# EAGLE design IN-2 Clock (EAGLE 8.1.0)
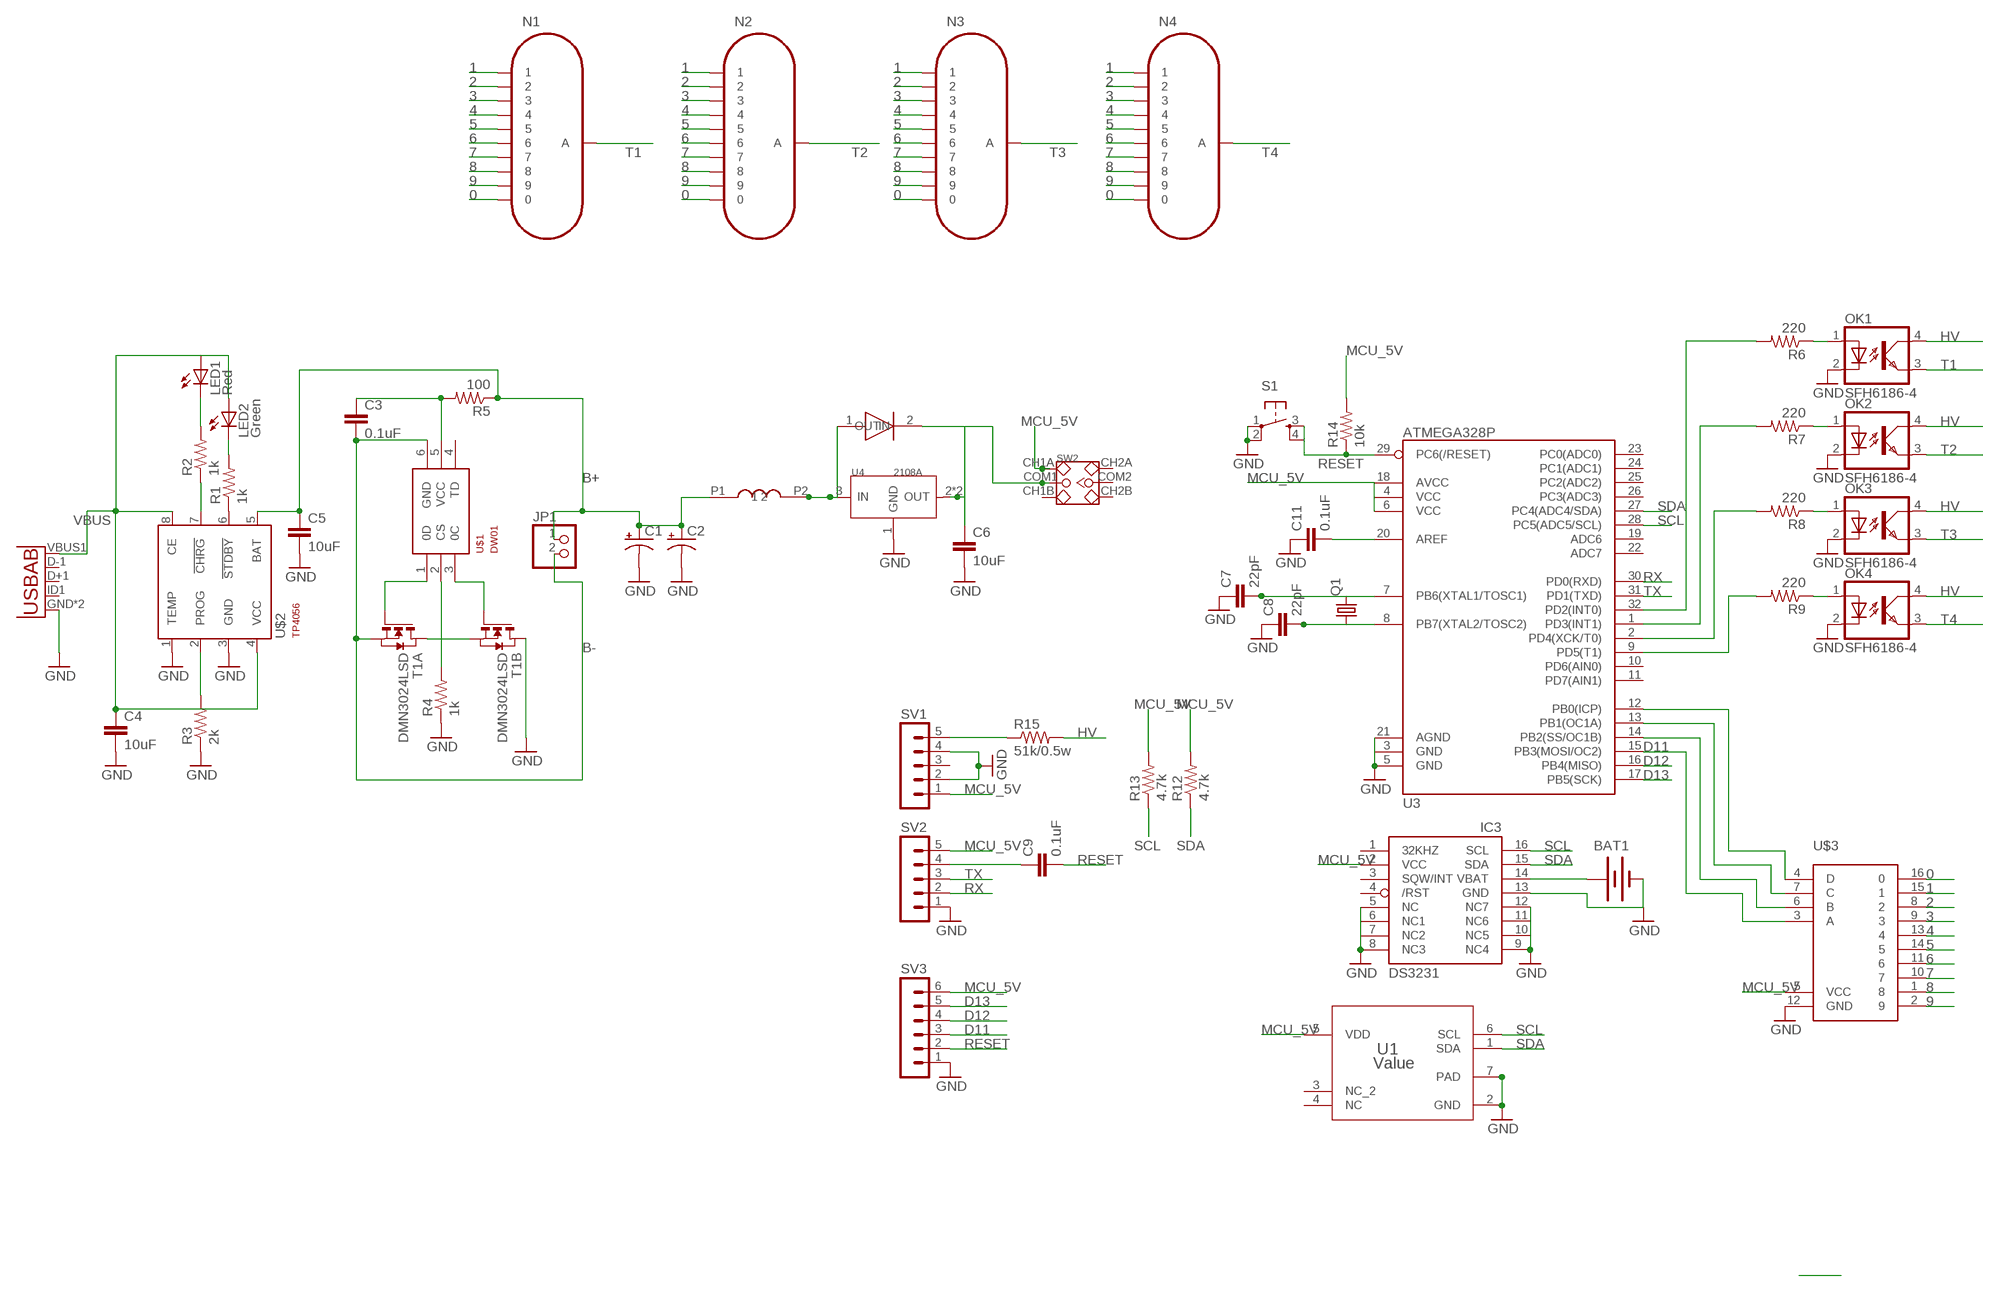
[diagram p0: schematic, sheet 1]

## Parts
BAT1  BATTERY20PTH  [BATTCOM_20MM_PTH]
C1  CAP_POLF80  [NIPPON_F80]
C2  CAP_POLF80  [NIPPON_F80]
C3  0.1uF  0.1UF-25V-5%(0603)  [0603-CAP]
C4  10uF  0.1UF-25V-5%(0603)  [0603-CAP]
C5  10uF  0.1UF-25V-5%(0603)  [0603-CAP]
C6  10uF  0.1UF-25V-5%(0603)  [0603-CAP]
C7  22pF  0.1UF-25V-5%(0603)  [0603-CAP]
C8  22pF  0.1UF-25V-5%(0603)  [0603-CAP]
C9  0.1uF  0.1UF-25V-5%(0603)  [0603-CAP]
C11  0.1uF  0.1UF-25V-5%(0603)  [0603-CAP]
IC3  DS3231/SO  [SO16W]
JP1  PINHD-1X2  [1X02]
LED1  Red  LEDCHIP-LED0805  [CHIP-LED0805]
LED2  Green  LEDCHIP-LED0805  [CHIP-LED0805]
N1  IN-2  [IN-8]
N2  IN-2  [IN-8]
N3  IN-2  [IN-8]
N4  IN-2  [IN-8]
OK1  SFH6186-4  [SMD4-7]
OK2  SFH6186-4  [SMD4-7]
OK3  SFH6186-4  [SMD4-7]
OK4  SFH6186-4  [SMD4-7]
Q1  CRYSTALSM49  [SM49]
R1  1k  1.2MOHMS-1/10W-1%(0603)  [0603-RES]
R2  1k  1.2MOHMS-1/10W-1%(0603)  [0603-RES]
R3  2k  1.2MOHMS-1/10W-1%(0603)  [0603-RES]
R4  1k  1.2MOHMS-1/10W-1%(0603)  [0603-RES]
R5  100  1.2MOHMS-1/10W-1%(0603)  [0603-RES]
R6  220  1.2MOHMS-1/10W-1%(0603)  [0603-RES]
R7  220  1.2MOHMS-1/10W-1%(0603)  [0603-RES]
R8  220  1.2MOHMS-1/10W-1%(0603)  [0603-RES]
R9  220  1.2MOHMS-1/10W-1%(0603)  [0603-RES]
R12  4.7k  1.2MOHMS-1/10W-1%(0603)  [0603-RES]
R13  4.7k  1.2MOHMS-1/10W-1%(0603)  [0603-RES]
R14  10k  1.2MOHMS-1/10W-1%(0603)  [0603-RES]
R15  51k/0.5w  R-US_0207/12  [0207/12]
S1  TAC_SWITCHSMD  [TACTILE_SWITCH_SMD]
SV1  MA05-1  [MA05-1]
SV2  MA05-1  [MA05-1]
SV3  MA06-1  [MA06-1]
SW2  SMD-TOGGLE-SWITCH-2CH(2X3P-7X3.5MM)  [SW6-2.54-SMD-7.0X3.5X1.5MM]
T1  DMN3024LSD  [TSSOP-8]
U1  Value  HDC1080DMBR  [DMB0006A]
U2  USB""  [USB-MICRO-SMD]
U3  ATMEGA328P  ATMEGA328_SMT  [TQFP32-08]
U4  2108A  PMIC-CJA1117B-3.3(SOT-89)  [SOT-89]
U$1  DW01  [SOT23-6]
U$2  TP4056  [SOT23-8]
U$3  K155ID1  [DIL16-KIT]
U$5  22uH  CD54  [CD54]
U$6  SS14  SMA-SS34  [SMA-SS34]

## Nets
0: N1.0 N2.0 N3.0 N4.0 U$3.16
1: N1.1 N2.1 N3.1 N4.1 U$3.15
2: N1.2 N2.2 N3.2 N4.2 U$3.8
3: N1.3 N2.3 N3.3 N4.3 U$3.9
4: N1.4 N2.4 N3.4 N4.4 U$3.13
5: N1.5 N2.5 N3.5 N4.5 U$3.14
6: N1.6 N2.6 N3.6 N4.6 U$3.11
7: N1.7 N2.7 N3.7 N4.7 U$3.10
8: N1.8 N2.8 N3.8 N4.8 U$3.1
9: N1.9 N2.9 N3.9 N4.9 U$3.2
B+: C1.+ C2.+ C5.1 JP1.1 R5.1 U$2.5(BAT) U$5.P1
B-: C3.2 JP1.2 T1.2(A:S) T1.3(A:S) U$1.6(GND)
D11: SV3.3 U3.15(PB3(MOSI/OC2)) U$3.3(A)
D12: SV3.4 U3.16(PB4(MISO))
D13: SV3.5 U3.17(PB5(SCK))
GND: BAT1.2(-) C1.- C2.- C4.2 C5.2 C6.2 C7.1 C8.1 C11.1 IC3.5(NC) IC3.6(NC1) IC3.7(NC2) IC3.8(NC3) IC3.9(NC4) IC3.10(NC5) IC3.11(NC6) IC3.12(NC7) IC3.13(GND) OK1.2(C) OK2.2(C) OK3.2(C) OK4.2(C) R3.1 R4.1 S1.1 S1.2 SV1.2 SV1.4 SV2.1 SV3.1 T1.8(B:D) U1.2(GND) U1.7(PAD) U2.GND U2.GND1(GND) U3.3(GND) U3.5(GND) U3.21(AGND) U4.1(GND) U$2.1(TEMP) U$2.3(GND) U$3.12(GND)
HV: OK1.4(COL) OK2.4(COL) OK3.4(COL) OK4.4(COL) R15.2
MCU_5V: IC3.2(VCC) R12.2 R13.2 R14.2 SV1.1 SV2.5 SV3.6 SW2.CH1A U1.5(VDD) U3.4(VCC) U3.6(VCC) U3.18(AVCC) U$3.5(VCC)
N$1: LED2.C R1.2
N$2: R1.1 U$2.6(!STDBY)
N$3: LED1.C R2.2
N$4: R2.1 U$2.7(!CHRG)
N$5: R3.2 U$2.2(PROG)
N$6: U4.3(IN) U$5.P2 U$6.1(IN)
N$7: C6.1 SW2.COM1 U4.2(OUT) U4.4(OUT) U$6.2(OUT)
N$8: T1.1(A:D) T1.6(B:S) T1.7(B:S)
N$9: T1.4(A:G) U$1.1(0D)
N$10: T1.5(B:G) U$1.3(0C)
N$11: R4.2 U$1.2(CS)
N$13: C3.1 R5.2 U$1.5(VCC)
N$15: C7.2 Q1.2 U3.7(PB6(XTAL1/TOSC1))
N$16: C8.2 Q1.1 U3.8(PB7(XTAL2/TOSC2))
N$17: BAT1.1(+) IC3.14(VBAT)
N$18: C11.2 U3.20(AREF)
N$19: R15.1 SV1.5
N$22: OK1.1(A) R6.1
N$23: OK2.1(A) R7.1
N$24: OK3.1(A) R8.1
N$25: OK4.1(A) R9.1
N$28: R6.2 U3.32(PD2(INT0))
N$29: R7.2 U3.1(PD3(INT1))
N$30: R8.2 U3.2(PD4(XCK/T0))
N$31: R9.2 U3.9(PD5(T1))
N$34: U3.12(PB0(ICP)) U$3.4(D)
N$35: U3.13(PB1(OC1A)) U$3.7(C)
N$36: U3.14(PB2(SS/OC1B)) U$3.6(B)
N$41: C9.1 SV2.4
RESET: C9.2 R14.1 S1.3 S1.4 SV3.2 U3.29(PC6(/RESET))
RX: SV2.2 U3.30(PD0(RXD))
SCL: IC3.16(SCL) R13.1 U1.6(SCL) U3.28(PC5(ADC5/SCL))
SDA: IC3.15(SDA) R12.1 U1.1(SDA) U3.27(PC4(ADC4/SDA))
T1: N1.A OK1.3(EMIT)
T2: N2.A OK2.3(EMIT)
T3: N3.A OK3.3(EMIT)
T4: N4.A OK4.3(EMIT)
TX: SV2.3 U3.31(PD1(TXD))
VBUS: C4.1 LED1.A LED2.A U2.VBUS1(VBUS) U$2.4(VCC) U$2.8(CE)
Unconnected: IC3.1(32KHZ) IC3.3(SQW/INT) IC3.4(/RST) SV1.3 SW2.CH1B SW2.CH2A SW2.CH2B SW2.COM2 U1.3(NC_2) U1.4(NC) U2.D+1(D+) U2.D-1(D-) U2.ID1(USBID) U3.10(PD6(AIN0)) U3.11(PD7(AIN1)) U3.19(ADC6) U3.22(ADC7) U3.23(PC0(ADC0)) U3.24(PC1(ADC1)) U3.25(PC2(ADC2)) U3.26(PC3(ADC3)) U$1.4(TD)

## Library data of the parts
BAT1 = SparkFun-Electromechanical:BATTERY: Battery Holders Various common sizes : AA, AAA, 20mm coin cell and 12mm coin cell. 20MM_4LEGS, BATT-10373
C1 C2 = SparkFun-Capacitors:CAP_POL: Capacitor Polarized These are standard SMD and PTH capacitors. Normally 10uF, 47uF, and 100uF in electrolytic and tantalum varieties. Always verify the external diameter of the through hole cap, it varies with capacity, voltage, and manufacturer. The EIA devices should be standard.
C3 C9 C11 = SparkFun-Capacitors:0.1UF-25V-5%(0603): CAP-08604; PROD_ID: CAP-08604
C4-C8 = SparkFun-Capacitors:0.1UF-25V-5%(0603): CAP-08604; PROD_ID: CAP-08604; VALUE: 0.1uF
IC3 = adafruit:DS3231
JP1 = pinhead:PINHD-1X2: PIN HEADER
LED1 LED2 = adafruit:LED: LED OSRAM: - CHIPLED LG R971, LG N971, LY N971, LG Q971, LY Q971, LO R971, LY R971 LH N974, LH R974 LS Q976, LO Q976, LY Q976 LO Q996 - Hyper CHIPLED LW Q18S LB Q993, LB Q99A, LB R99A - SideLED LS A670, LO A670, LY A670, LG A670, LP A670 LB A673, LV A673, LT A673, LW A673 LH A674 LY A675 LS A676, LA A676, LO A676, LY A676, LW A676 LS A679, LY A679, LG A679 - Hyper Micro SIDELED® LS Y876, LA Y876, LO Y876, LY Y876 LT Y87S - SmartLED LW L88C, LW L88S LB L89C, LB L89S, LG L890 LS L89K, LO L89K, LY L89K LS L896, LA L896, LO L896, LY L896 - TOPLED LS T670, LO T670, LY T670, LG T670, LP T670 LSG T670, LSP T670, LSY T670, LOP T670, LYG T670 LG T671, LOG T671, LSG T671 LB T673, LV T673, LT T673, LW T673 LH T674 LS T676, LA T676, LO T676, LY T676, LB T676, LH T676, LSB T676, LW T676 LB T67C, LV T67C, LT T67C, LS T67K, LO T67K, LY T67K, LW E67C LS E67B, LA E67B, LO E67B, LY E67B, LB E67C, LV E67C, LT E67C LW T67C LS T679, LY T679, LG T679 LS T770, LO T770, LY T770, LG T770, LP T770 LB T773, LV T773, LT T773, LW T773 LH T774 LS E675, LA E675, LY E675, LS T675 LS T776, LA T776, LO T776, LY T776, LB T776 LHGB T686 LT T68C, LB T68C - Hyper Mini TOPLED® LB M676 - Mini TOPLED Santana® LG M470 LS M47K, LO M47K, LY M47K Source: http://www.osram.convergy.de/
N1-N4 = russian-nixies:IN-2: IN-2: tiny numeric topview nixie tube
OK1-OK4 = optocoupler:SFH618?*: Optocoupler, Phototransistor Output, Low Input Current Source: Data sheet <http://www.vishay.com/docs/83673/sfh618.pdf>; MF: VISHAY/TELEFUNKEN; MPN: SFH6186-4; OC_FARNELL: 1469530; OC_NEWARK: 21H7753
Q1 = adafruit:CRYSTAL: CRYSTAL; OC_FARNELL: unknown; OC_NEWARK: unknown
R1-R9 R12-R14 = SparkFun-Resistors:1.2MOHMS-1/10W-1%(0603): RES-10055; PROD_ID: RES-10055; VALUE: 1.2M
R15 = resistor:R-US_: RESISTOR, American symbol
S1 = SparkFun-Electromechanical:TAC_SWITCH: Momentary Switch Button commonly used for reset or general input. Spark Fun Electronics SKU : COM-00097 SMT- SWCH-08247; PROD_ID: SWCH-08247
SV1 SV2 = con-lstb:MA05-1: PIN HEADER; OC_FARNELL: unknown; OC_NEWARK: unknown
SV3 = con-lstb:MA06-1: PIN HEADER; OC_FARNELL: unknown; OC_NEWARK: unknown
SW2 = Seeed-OPL-Switch:SMD-TOGGLE-SWITCH-2CH(2X3P-7X3.5MM): 311030005
T1 = FS8205A:DMN3024LSD: DUAL N-CHANNEL ENHANCEMENT MODE MOSFET data sheet <http://goo.gl/dRgboR> Dave.Calaway Eagle Library <https://goo.gl/Muy1Tr>
U1 = HDC1080:HDC1080DMBR; ALTERNATEPARTNUMBER: HDC1080DMBT; APPLICATION_BUILDNUMBER: *; COMPTYPE: IC; MANUFACTURER: Texas Instruments; MOUNTTYPE: SMT; PACKAGEREFERENCE: DMB0006A; PARTNUMBER: HDC1080DMBR; PIN_COUNT: 7; REFDES: RefDes; TYPE: TYPE
U2 = MicroUSB Long:USB: This is a USB AB connector that is compatible with USB OTG. i.e. this connector can serve as a host or device
U3 = SparkFun-DigitalIC:ATMEGA328_SMT: 32-Pin Atmega328 part Commonly used on Arduino compatible boards Available in QFP and QFN packages TQFP is IC-09069 QFN is non-stock; PROD_ID: IC-09069
U4 = Seeed-OPL-ic:PMIC-CJA1117B-3.3(SOT-89): 310030095; MPN: CJA1117B-3.3; VALUE: CJA1117B-3.3-SOT89
U$1 = DW01:DW01: The DW01-P battery protection IC is designed to protect lithium-ion/polymer battery from damage or degrading the lifetime due to overcharge, overdischarge, and/or overcurrent for one-cell lithium-ion/polymer battery powered systems, such as cellular phones. Data sheet <http://goo.gl/4y108d> Dave.Calaway Eagle Library <https://goo.gl/Muy1Tr>
U$2 = TP4056:TP4056: TP4056 Data sheet <http://goo.gl/J7k8TF> Dave.Calaway Eagle Library <https://goo.gl/Muy1Tr>
U$3 = Nixie:K155ID1
U$5 = CD54:CD54
U$6 = SMA-SS34:SMA-SS34

## Board
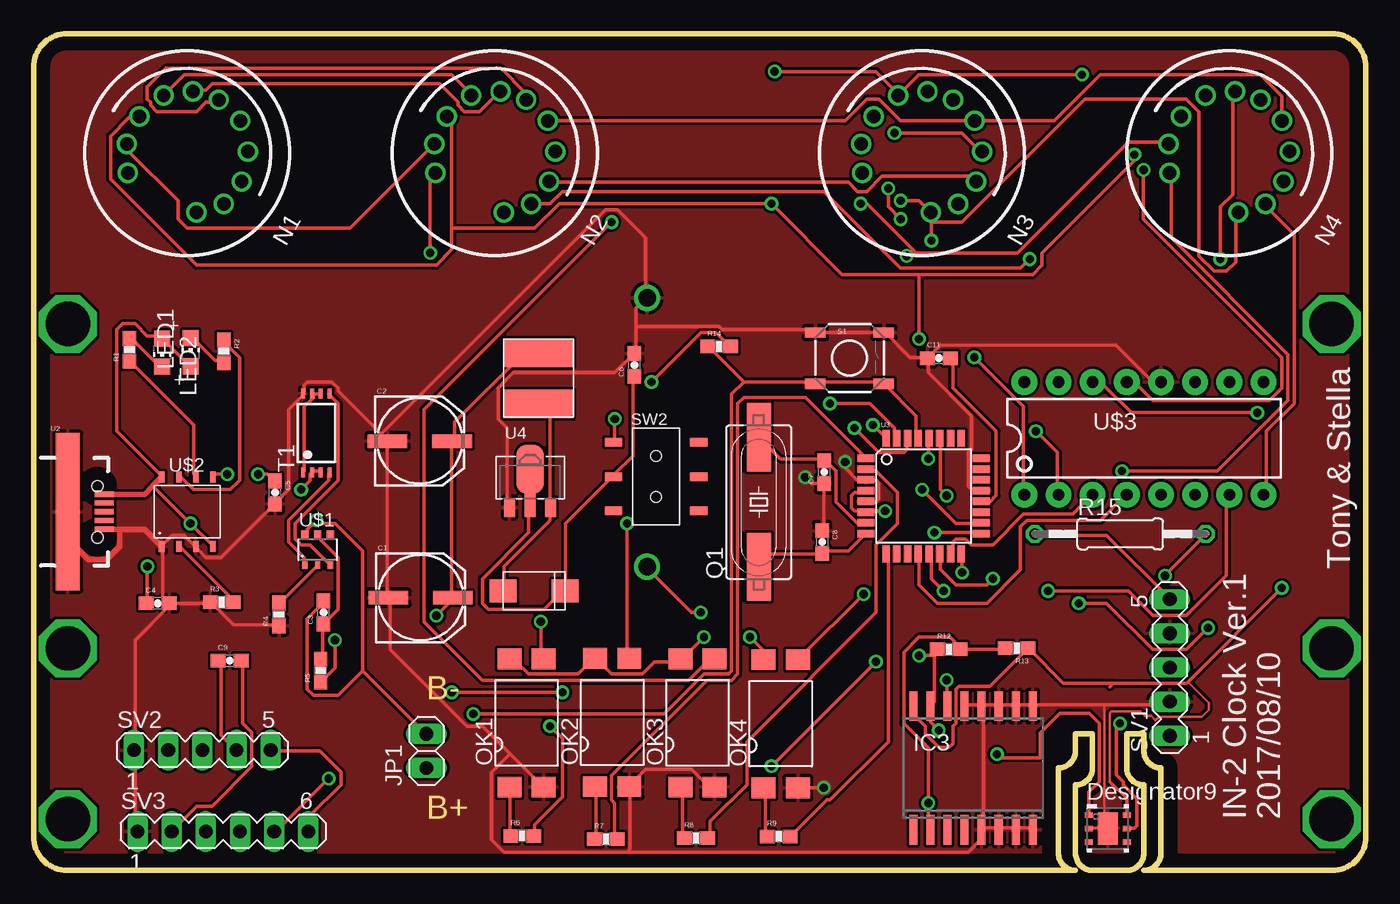
[diagram p1: board, top side]
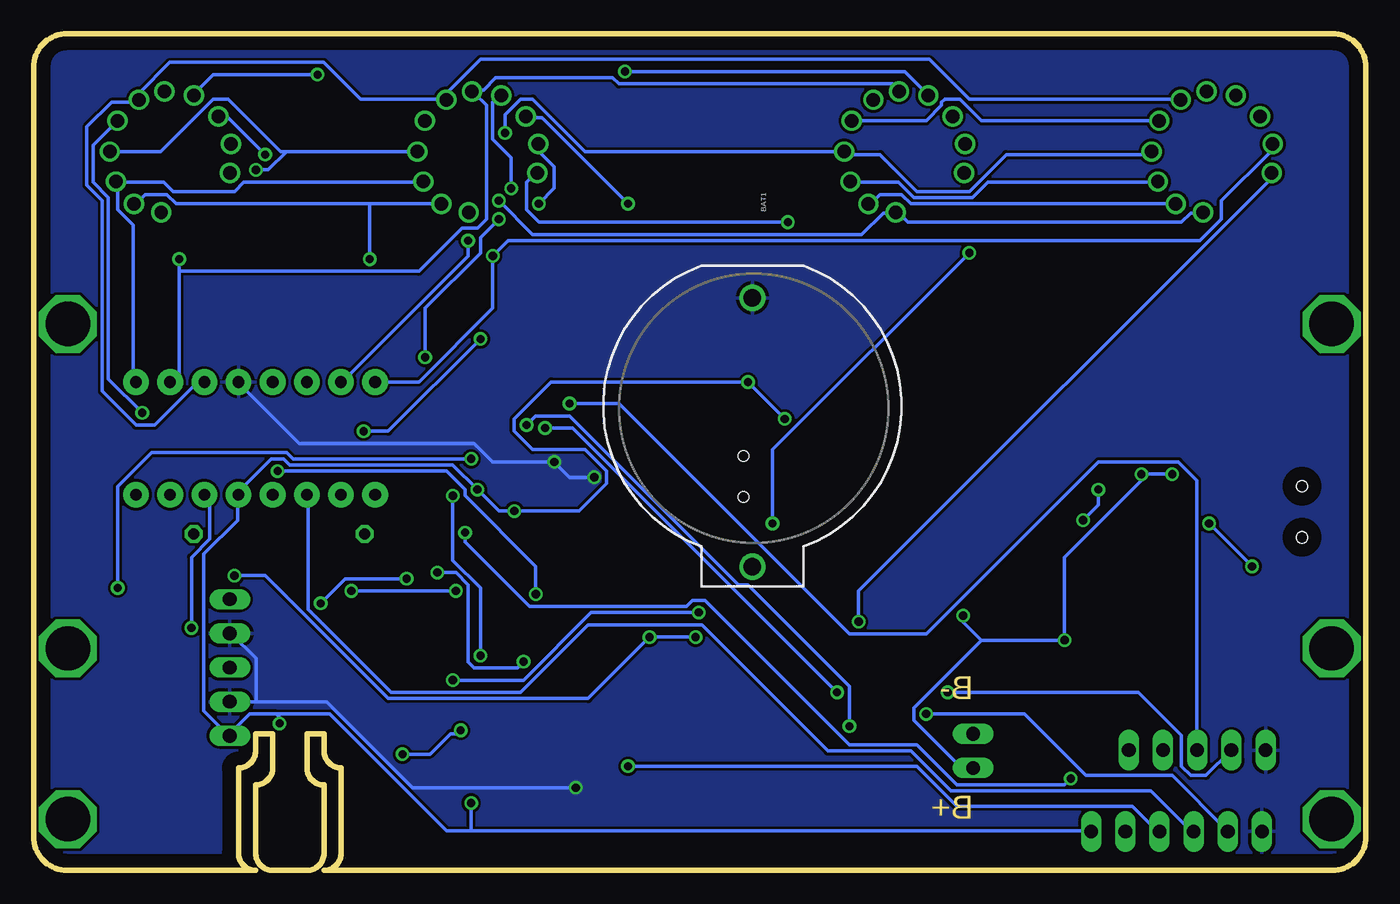
[diagram p2: board, bottom side, seen from below]

Size 99.06 x 62.23 mm. Coordinates in mm from the lower left corner, seen from the top.
Outline: 96.56,0 82.55,0 arc90 83.82,1.27 83.82,7.62 arc-90 82.55,8.89 82.55,10.16 81.28,10.16 81.28,7.62 arc90 82.55,6.35 82.55,1.27 arc-90 81.28,0 78.74,0 arc-90 77.47,1.27 77.47,6.35 arc90 78.74,7.62 78.74,10.16 77.47,10.16 77.47,8.89 arc-90 76.2,7.62 76.2,1.27 arc90 77.47,0 2.5,0 arc-90 0,2.5 0,59.73 arc-90 2.5,62.23 96.56,62.23 arc-90 99.06,59.73 99.06,2.5 arc-90 96.56,0
Copper layers (1*16): Top 0.035mm / dielectric 1.5mm / Bottom 0.035mm
Design rules "default": minimum track width 10mil, minimum drill 24mil, track to track 8mil, track to pad 8mil, pad to pad 8mil, via to via 8mil, smd to smd 8mil, copper to edge 40mil, drill to drill 8mil, minimum pad ring 10mil, minimum via ring 8mil, stop-mask expansion 4mil, vias tented up to drill 0mil, thermal gap 10mil

### Footprints (pad centres in the part's own frame; a part is rotated, then mirrored left to right if it is on the bottom)
BATTCOM_20MM_PTH = drill 1.3: 1 11.85,0; 2 -8.15,0
NIPPON_F80 = smd 2.95 x 1: + 2.4,0; - -2.4,0
0603-CAP = smd 1.1 x 1: 1 -0.85,0; 2 0.85,0
SO16W = smd 0.6 x 2.2: 1 -4.445,-4.6; 2 -3.175,-4.6; 3 -1.905,-4.6; 4 -0.635,-4.6; 5 0.635,-4.6; 6 1.905,-4.6; 7 3.175,-4.6; 8 4.445,-4.6; 9 4.445,4.6; 10 3.175,4.6; 11 1.905,4.6; 12 0.635,4.6; 13 -0.635,4.6; 14 -1.905,4.6; 15 -3.175,4.6; 16 -4.445,4.6
1X02 = drill 1.016 long: 1 -1.27,0; 2 1.27,0
CHIP-LED0805 = smd 1.2 x 1.2: A 0,-1.05; C 0,1.05
IN-8 = drill 1: 0 -4.244,-1.655; 1 2.792,-3.483; 2 4.222,-1.907; 3 4.556,0.189; 4 3.837,2.348; 5 2.203,4.052; 6 0.034,4.603; 7 -1.928,4.186; 8 -3.666,2.83; 9 -4.461,0.584; A -3.101,-3.49
SMD4-7 = smd 1.78 x 1.55: 1 -1.27,-4.77; 2 1.27,-4.77; 3 1.27,4.77; 4 -1.27,4.77
SM49 = smd 5.08 x 1.778: 1 -4.826,0; 2 4.826,0
0603-RES = smd 1.1 x 1: 1 -0.85,0; 2 0.85,0
0207/12 = drill 0.813 octagon: 1 -6.35,0; 2 6.35,0
TACTILE_SWITCH_SMD = smd 1.524 x 0.762: 1 -2.54,1.905; 2 2.54,1.905; 3 -2.54,-1.905; 4 2.54,-1.905
MA05-1 = drill 1.016 long: 1 -5.08,0; 2 -2.54,0; 3 0,0; 4 2.54,0; 5 5.08,0
MA06-1 = drill 1.016 long: 1 -6.35,0; 2 -3.81,0; 3 -1.27,0; 4 1.27,0; 5 3.81,0; 6 6.35,0
SW6-2.54-SMD-7.0X3.5X1.5MM = smd 1.27 x 0.635: CH1A -3.175,2.54; CH1B -3.175,-2.54; CH2A 3.175,2.54; CH2B 3.175,-2.54; COM1 -3.175,0; COM2 3.175,0 | hole 0.813: 0,1.524; 0,-1.524
TSSOP-8 = smd 0.3 x 0.75: 1 -0.975,-2.925; 2 -0.325,-2.925; 3 0.325,-2.925; 4 0.975,-2.925; 5 0.975,2.925; 6 0.325,2.925; 7 -0.325,2.925; 8 -0.975,2.925
DMB0006A = smd 0.6 x 0.4: 1 -1.4,1; 2 -1.4,0; 3 -1.4,-1; 4 1.4,-1; 5 1.4,0; 6 1.4,1 | smd 1.5 x 2.4: 7 0,0 | smd 0.5 x 0.5: V -0.5,0
USB-MICRO-SMD = smd 1.4 x 0.4: D+1 2.7,0; D-1 2.7,0.65; GND1 2.7,-1.3; ID1 2.7,-0.65; VBUS1 2.7,1.3 | smd 1.778 x 11.684: GND 0,0 | hole 0.85: 2.2,1.9; 2.2,-1.9
TQFP32-08 = smd 1.27 x 0.559: 1 -4.293,2.8; 2 -4.293,2; 3 -4.293,1.2; 4 -4.293,0.4; 5 -4.293,-0.4; 6 -4.293,-1.2; 7 -4.293,-2; 8 -4.293,-2.8; 17 4.293,-2.8; 18 4.293,-2; 19 4.293,-1.2; 20 4.293,-0.4; 21 4.293,0.4; 22 4.293,1.2; 23 4.293,2; 24 4.293,2.8 | smd 0.559 x 1.27: 9 -2.8,-4.293; 10 -2,-4.293; 11 -1.2,-4.293; 12 -0.4,-4.293; 13 0.4,-4.293; 14 1.2,-4.293; 15 2,-4.293; 16 2.8,-4.293; 25 2.8,4.293; 26 2,4.293; 27 1.2,4.293; 28 0.4,4.293; 29 -0.4,4.293; 30 -1.2,4.293; 31 -2,4.293; 32 -2.8,4.293
SOT-89 = smd 0.8 x 1.4: 1 -1.524,-1.905; 3 1.524,-1.905 | smd 0.8 x 1.9: 2 0,-1.651 | smd 2.032 x 3.65: 4 0,0.94
SOT23-6 = smd 0.4 x 0.55: 1 -0.95,-1.15; 2 0,-1.15; 3 0.95,-1.15 | smd 0.55 x 0.55: 4 0.95,1.15; 5 0,1.15; 6 -0.95,1.15
SOT23-8 = smd 0.42 x 0.835: 1 -1.905,-2.58; 2 -0.635,-2.58; 3 0.635,-2.58; 4 1.905,-2.58; 5 1.905,2.58; 6 0.635,2.58; 7 -0.635,2.58; 8 -1.905,2.58
DIL16-KIT = drill 0.864 pad 1.905: 1 -8.89,-4.191; 2 -6.35,-4.191; 3 -3.81,-4.191; 4 -1.27,-4.191; 5 1.27,-4.191; 6 3.81,-4.191; 7 6.35,-4.191; 8 8.89,-4.191; 9 8.89,4.191; 10 6.35,4.191; 11 3.81,4.191; 12 1.27,4.191; 13 -1.27,4.191; 14 -3.81,4.191; 15 -6.35,4.191; 16 -8.89,4.191
CD54 = smd 5.2 x 2.1: P1 2.6,-1; P2 2.6,-4.8
SMA-SS34 = smd 2 x 1.7: 1 0,-1.4; 2 4.6,-1.4

### Placement (x,y rotation side)
BAT1  45.61,34.43 270 bottom
C1  28.78,20.27 0 top
C2  28.71,31.93 0 top
C3  21.56,19.18 90 top
C4  9.22,19.86 0 top
C5  17.95,28.1 270 top
C6  44.67,37.59 90 top
C7  58.78,29.62 90 top
C8  58.63,24.41 270 top
C9  14.58,15.6 0 top
C11  67.31,38.1 0 top
IC3  69.85,7.62 0 top
JP1  29.21,8.89 90 top
LED1  11.68,38.54 0 top
LED2  9.56,38.51 180 top
N1  11.43,53.34 330 top
N2  34.29,53.34 330 top
N3  66.04,53.34 330 top
N4  88.9,53.34 330 top
OK1  36.65,10.97 0 top
OK2  43.02,11 0 top
OK3  49.37,10.97 0 top
OK4  55.55,10.9 0 top
Q1  53.92,27.39 90 top
R1  7.12,38.71 90 top
R2  14.15,38.6 270 top
R3  13.99,19.95 0 top
R4  18.24,19.04 90 top
R5  21.34,14.85 90 top
R6  36.33,2.57 0 top
R7  42.55,2.33 0 top
R8  49.25,2.4 0 top
R9  55.4,2.53 0 top
R12  68.05,16.44 0 top
R13  73.1,16.53 180 top
R14  50.97,38.96 0 top
R15  80.8,25.02 0 top
S1  60.67,38.1 0 top
SV1  84.48,15.09 90 top
SV2  12.54,8.94 0 top
SV3  14.08,2.9 0 top
SW2  46.28,29.29 0 top
T1  21.02,32.53 0 top
U1  79.87,3.12 0 top
U2  2.54,26.67 0 top
U3  66.18,27.84 0 top
U4  36.92,28.89 0 top
U$1  21.12,23.86 0 top
U$2  11.43,26.67 0 top
U$3  82.56,32.13 0 top
U$5  34.93,39.5 0 top
U$6  34.9,22.18 0 top

### Tracks (layer width: path | path; a pad name or v marks a point on that pad's centre or on a via)
0  (via drill 0.61)
  Top 0.254: N1.0 7.09,53.92 7.09,53.47 10.74,49.81 10.74,48.44 11.43,47.75 23.55,47.75 29.72,53.92 N2.0 | v61.49,49.58 61.95,49.58 65.38,46.15 | 65.38,46.15 65.61,45.92 73.15,45.92 81.38,54.15 84.35,54.15 N4.0 | 65.38,46.15 v64.92,45.7
  Bottom 0.254: v61.49,49.58 60.35,50.72 60.35,52.32 61.49,53.47 61.49,53.92 N3.0 | U$3.16 73.61,36.32 70.41,36.32 64.92,41.81 v64.92,45.7 63.78,46.84 12.34,46.84 10.74,48.44 10.74,49.81 7.09,53.47 7.09,53.92 N1.0
1  (via drill 0.61)
  Top 0.254: v66.75,46.84 66.75,48.21 | 66.75,48.21 66.75,48.9 N3.1 | 66.75,48.21 69.04,48.21 78.18,57.35 85.72,57.35 86.64,56.44 86.64,45.7 87.78,44.55 88.7,44.55 89.38,45.24 89.38,48.9 N4.1 | 66.75,48.21 N3.1 | v64.47,49.81 65.84,49.81 66.52,49.12 N3.1
  Bottom 0.254: N1.1 12.12,48.9 13.03,48.9 13.72,48.21 34.06,48.21 34.75,48.9 N2.1 34.98,48.9 35.89,48.9 37.49,47.3 61.95,47.3 v64.47,49.81 | v66.75,46.84 66.75,45.7 76.12,36.32 U$3.15
2  (via drill 0.61)
  Top 0.254: U$3.8 91.67,28.09 91.67,32.66 93.73,34.72 93.73,47.3 91.67,49.35 N4.2 | v74.07,45.47 73.38,44.78 64.47,44.78 58.75,50.49 39.32,50.49 38.41,49.58 37.03,49.58 N2.2
  Bottom 0.254: N1.2 14.17,49.58 33.83,49.58 34.52,50.27 36.12,50.27 36.8,49.58 N2.2 | 74.07,49.58 88.47,49.58 89.15,50.27 90.75,50.27 91.44,49.58 N4.2 | 74.07,49.58 68.81,49.58 N3.2 | 74.07,49.58 v74.07,45.47
3
  Top 0.254: N2.3 38.41,51.18 60.58,51.18 61.27,50.49 61.95,50.49 63.09,51.64 69.72,51.64 69.95,51.41 N3.3
  Bottom 0.254: N1.3 15.54,51.18 28.12,51.18 29.26,50.04 33.6,50.04 34.75,51.18 38.18,51.18 N2.3 | 92.81,51.18 89.38,51.18 88.7,50.49 84.12,50.49 83.44,51.18 70.18,51.18 N3.3 | 92.81,51.18 92.81,49.12 91.67,47.98 91.67,36.32 U$3.9 | 92.81,51.18 N4.3
4  (via drill 0.61)
  Top 0.254: v82.53,52.09 82.53,48.44 92.81,38.15 92.81,35.87 91.9,34.95 83.21,34.95 82.07,36.09 81.38,36.09 U$3.13 | v64.01,54.84 69.04,54.84 70.41,53.47 N3.4
  Bottom 0.254: N1.4 16,53.24 26.75,53.24 29.49,50.49 33.38,50.49 36.12,53.24 38.63,53.24 N2.4 38.86,53.47 58.06,53.47 61.95,57.35 62.87,57.35 64.01,56.21 v64.01,54.84 | 80.24,53.47 80.7,53.47 84.58,57.35 85.72,57.35 89.61,53.47 93.27,53.47 N4.4 | 80.24,53.47 70.64,53.47 N3.4 | v82.53,52.09 81.61,52.09 80.24,53.47
5  (via drill 0.61)
  Top 0.254: N4.5 92.81,55.75 92.81,57.58 91.21,59.18 79.32,59.18 75.9,55.75 70.18,55.75 N3.5 69.95,55.75 64.47,55.75 62.87,57.35 61.95,57.35 60.35,55.75 38.41,55.75 N2.5 | v90.98,34.04 81.61,34.04 79.55,36.09 78.87,36.09 U$3.14
  Bottom 0.254: N1.5 15.54,55.75 28.57,55.75 30.18,57.35 31.32,57.35 31.55,57.12 31.55,56.9 32.69,55.75 38.18,55.75 N2.5 | v90.98,34.04 93.5,36.55 93.5,50.04 94.64,51.18 94.64,53.92 93.04,55.52 N4.5
6
  Top 0.254: N1.6 13.72,57.12 12.8,57.12 12.12,56.44 9.14,56.44 8.69,56.9 8.69,57.12 8.46,57.35 8.46,58.27 9.83,59.64 34.75,59.64 36.58,57.81 36.58,57.35 N2.6
  Bottom 0.254: 68.81,57.35 74.75,57.35 77.5,60.1 88.93,60.1 91.21,57.81 91.21,57.35 N4.6 91.44,57.12 93.27,57.12 95.1,55.3 95.1,50.95 93.96,49.81 93.96,35.64 91.44,33.12 90.07,33.12 87.1,36.09 86.41,36.09 U$3.11 | 68.81,57.35 68.58,57.35 N3.6 68.81,57.35 | 68.81,57.35 65.84,60.33 32.46,60.33 29.49,57.35 13.95,57.35 N1.6
7  (via drill 0.61)
  Top 0.254: v88.24,45.47 88.24,49.35 89.15,50.27 89.15,57.81 N4.7 | N1.7 11.89,58.04 12.8,58.04 13.26,58.5 30.18,58.5 31.55,57.12 31.55,56.9 32,56.44 33.15,56.44 34.52,57.81 N2.7
  Bottom 0.254: 88.24,44.55 88.24,36.78 88.7,36.32 U$3.10 | 88.24,44.55 v88.24,45.47 | N2.7 34.75,58.04 35.2,58.5 55.55,58.5 56.01,58.95 64.69,58.95 65.61,58.04 66.29,58.04 N3.7 66.29,57.81 65.38,56.9 65.38,48.44 66.06,47.75 67.21,47.75 70.41,44.55 88.24,44.55
8  (via drill 0.61)
  Top 0.254: N1.8 9.83,57.81 11.2,59.18 31.09,59.18 32.46,57.81 N2.8 | v77.95,59.18 65.84,59.18 64.47,57.81 N3.8 64.24,57.81 62.64,59.41 v55.09,59.41 | v69.95,38.15 73.61,34.49 73.61,28.09 U$3.1 | v64.47,48.44 63.55,49.35 v63.55,50.72
  Bottom 0.254: v77.95,59.18 85.72,59.18 87.1,57.81 N4.8 | v69.95,38.15 69.95,41.81 65.84,45.92 65.84,47.07 v64.47,48.44 | v63.55,50.72 63.55,53.01 64.92,54.38 64.92,57.12 64.47,57.58 N3.8 | v55.09,59.41 34.29,59.41 32.69,57.81 N2.8
9  (via drill 0.61)
  Top 0.254: 31.09,47.75 31.09,55.75 30.86,55.98 N2.9 | 31.09,47.75 31.09,46.15 29.95,45.01 12.12,45.01 5.71,51.41 5.71,54.61 7.09,55.98 7.77,55.98 N1.9 | 31.09,47.75 37.26,47.75 39.09,49.58 v54.86,49.58 60.12,44.32 65.84,44.32 | v81.84,53.24 81.84,52.78 74.98,45.92 74.98,45.01 74.3,44.32 65.84,44.32 | v74.52,32.66 76.12,31.06 76.12,28.09 U$3.2 | 65.84,44.32 v65.84,39.52
  Bottom 0.254: v54.86,49.58 61.27,55.98 62.41,55.98 N3.9 | v81.84,53.24 84.58,55.98 85.27,55.98 N4.9 | v74.52,32.66 72.69,32.66 v65.84,39.52
B+  (via drill 0.61)
  Top 0.254: U$5.P1 37.49,38.38 36.35,38.38 31.32,33.35 31.32,31.98 C2.+ 31.09,31.75 31.09,20.32 C1.+ 31.09,20.09 v29.95,18.95 | v14.4,29.46 13.49,29.46 U$2.5 | v16.69,29.46 17.37,29.46 17.83,29.01 C5.1 | v22.4,17.12 22.4,15.06 21.49,14.15 R5.1
  Bottom 0.254: 16.23,29.46 v14.4,29.46 | 16.23,29.46 22.4,23.29 v22.4,17.12 28.57,17.12 | 16.23,29.46 v16.69,29.46 | 28.57,17.12 33.6,12.09 33.6,11.18 30.18,7.75 29.26,7.75 JP1.1 | v29.95,18.95 29.95,18.49 28.57,17.12
B-  (via drill 0.61)
  Top 0.254: T1.3 21.26,29.69 20.8,29.69 T1.2 20.57,29.46 20.57,29.01 v19.89,28.32 | 21.03,25.81 22.4,25.81 24.46,23.75 24.46,14.83 | 21.03,25.81 20.8,25.81 20.34,25.35 20.34,25.12 U$1.6 | 24.46,14.83 29.03,10.26 JP1.2 | 21.03,25.81 v21.03,26.04 | 24.46,14.83 22.63,13 20.8,13 20.34,13.46 20.34,18.72 21.49,19.86 C3.2
  Bottom 0.254: v19.89,28.32 19.89,27.18 v21.03,26.04
D11
  Top 0.254: U3.15 68.35,23.75 68.35,24.44 68.58,24.66 69.27,24.66 69.72,24.21 71.32,24.21 73.61,26.49 77.27,26.49 78.64,27.86 U$3.3
  Bottom 0.254: SV3.3 13.03,2.95 16,5.92 30.86,5.92 33.83,8.89 40,8.89 49.38,18.26 57.84,18.26 62.87,13.23 72.47,13.23 78.64,19.41 78.64,27.86 U$3.3
D12  (via drill 0.61)
  Top 0.254: v69.04,22.15 69.04,23.52 U3.16 | v54.86,7.75 v62.64,15.52
  Bottom 0.254: v69.04,22.15 67.67,22.15 66.75,21.23 66.75,15.52 66.29,15.06 63.09,15.06 v62.64,15.52 | v54.86,7.75 33.38,7.75 30.4,4.78 17.37,4.78 15.54,2.95 SV3.4
D13  (via drill 0.61)
  Top 0.254: v66.98,25.12 70.41,25.12 U3.17 | v21.95,6.83 18.06,2.95 SV3.5
  Bottom 0.254: v66.98,25.12 66.98,24.44 62.18,19.63 50.52,19.63 50.06,20.09 49.15,20.09 38.41,9.35 33.38,9.35 30.4,6.37 22.4,6.37 v21.95,6.83
GND  (via drill 0.61)
  Top 0.203: U1.7 79.63,3.36 79.63,12.32
  Top 0.254: C8.1 58.75,25.35 58.75,28.55 C7.1 58.75,28.78 57.84,28.78 v57.38,29.23 | U3.5 61.95,27.41 62.64,27.41 62.87,27.64 62.87,28.78 62.64,29.01 61.95,29.01 U3.3 61.72,29.01 61.27,29.01 60.35,29.92 v60.35,30.38 | C11.1 66.29,38.15 65.15,38.15 63.32,39.98 S1.2 63.09,39.98 58.29,39.98 S1.1 58.06,40.21 51.21,40.21 50.98,40.44 44.81,40.44 | U3.21 70.41,28.32 69.72,28.32 69.49,28.55 69.49,31.06 69.72,31.29 69.72,33.81 66.52,37.01 66.52,37.92 C11.1 | 44.81,40.44 44.81,41.81 45.49,42.49 BAT1.2 45.49,42.72 45.49,47.07 43.43,49.12 42.52,49.12 25.83,32.44 | 44.81,40.44 44.81,38.61 C6.2 44.58,38.38 43.2,37.01 35.66,37.01 34.52,35.87 34.52,33.58 35.2,32.89 35.2,27.18 U4.1 | U$3.12 83.67,36.32 83.21,36.32 80.47,39.06 67.44,39.06 66.52,38.15 C11.1 | 70.64,3.17 71.55,3.17 IC3.6 71.78,3.17 72.92,3.17 IC3.7 73.15,3.17 74.3,3.17 IC3.8 | 74.3,12.32 73.15,12.32 IC3.10 72.92,12.32 71.78,12.32 IC3.11 71.55,12.32 70.64,12.32 IC3.12 | IC3.13 69.27,12.32 70.41,12.32 IC3.12 | 70.64,3.17 70.64,12.09 IC3.12 | 70.64,3.17 IC3.5 70.41,2.95 70.41,2.26 69.49,1.35 44.12,1.35 | v58.75,6.15 56.92,6.15 OK4.2 | 74.3,12.32 79.63,12.32 84.12,12.32 84.35,12.55 SV1.2 | 74.3,12.32 IC3.9 | OK3.2 50.52,6.37 50.06,6.37 48.92,7.52 45.49,7.52 44.35,6.37 OK2.2 44.35,6.15 44.35,1.58 44.12,1.35 | 35.43,8.66 33.38,10.72 32.23,10.72 26.52,16.43 26.52,20.09 C1.- 26.29,20.32 26.29,31.75 C2.- 26.29,31.98 25.83,32.44 | 35.43,8.66 37.72,6.37 OK1.2 | 44.12,1.35 34.98,1.35 34.06,2.26 34.06,7.29 35.43,8.66 | 25.83,32.44 22.63,35.64 22.63,35.87 22.17,36.32 20.34,36.32 20.12,36.09 20.12,35.64 T1.8 20.12,35.41 18.97,34.27 18.97,28.32 18.06,27.41 C5.2 17.83,27.18 13.95,23.29 12.8,23.29 12.12,23.98 U$2.3 11.89,24.21 11.2,24.89 10.29,24.89 9.6,24.21 U$2.1 9.6,23.98 9.6,20.32 10.06,19.86 C4.2
  Top 0.254: SV3.1 7.54,2.95 7.54,8.89 SV2.1 7.54,9.12 7.54,17.12 10.06,19.63 C4.2 | C4.2 10.29,19.86 13.03,19.86 R3.1 13.26,19.86 14.86,18.26 18.06,18.26 R4.1 | U1.2 79.1,3.17 79.78,3.86 80.01,3.86 80.47,3.4 80.47,3.17 U1.7
  Top 0.406: 6.38,25.37 U2.GND1 | 6.38,25.37 8.24,25.37 U$2.1 | 6.38,25.37 6.38,24.09 5.42,23.13 4.06,23.13 3.1,24.09 3.1,26.11 U2.GND
  Bottom 0.254: U$3.12 83.67,36.09 79.32,31.75 66.29,31.75 64.92,30.38 v60.35,30.38 59.21,29.23 v57.38,29.23 | v58.75,6.15 70.87,6.15 77.27,12.55 82.53,12.55 | 82.53,12.55 84.35,12.55 SV1.2 | 82.53,12.55 82.53,15.75 84.35,17.58 SV1.4
  pour Top: 0,63.5 100.33,63.5 100.33,0 100.33,-1.27 -1.27,-1.27 -1.27,63.5
  pour Bottom: 0,63.5 100.33,63.5 100.33,-1.27 -1.27,-1.27 -1.27,63.5
HV  (via drill 0.61)
  Top 0.254: OK1.4 35.43,15.52 35.89,15.52 36.8,14.61 40.46,14.61 41.61,15.75 OK2.4 41.83,15.75 42.98,14.61 45.26,14.61 46.18,15.52 48.01,15.52 OK3.4 48.23,15.75 v49.84,17.35 | v53.26,17.35 54.18,16.43 54.18,15.75 OK4.4 | v84.12,21.92 87.1,24.89 R15.2
  Bottom 0.254: v49.84,17.35 v53.26,17.35 57.84,12.78 72.69,12.78 81.84,21.92 v84.12,21.92
MCU_5V  (via drill 0.6 pad 0.3, 0.61)
  Top 0.254: R13.2 72.24,16.43 69.04,16.43 R12.2 68.81,16.66 68.12,17.35 65.84,17.35 64.69,16.21 64.69,10.95 66.52,9.12 v66.52,5 66.52,3.17 IC3.2 | v45.95,36.32 49.61,39.98 50.75,39.98 51.66,39.06 R14.2 | v43.2,33.58 43.2,31.98 SW2.CH1A | SV3.6 20.57,2.95 20.57,4.09 22.86,6.37 22.86,7.29 21.26,8.89 17.83,8.89 SV2.5 | U3.4 61.72,28.09 61.04,28.09 60.81,27.86 60.81,26.95 61.04,26.72 61.72,26.72 U3.6 61.95,26.72 v63.32,26.72 | v66.06,28.32 68.58,25.81 70.41,25.81 U3.18 | U1.5 81.86,3.12 82.04,3.3 82.04,5.33 81.03,6.35 81.03,6.6 80.52,7.11 80.52,10.67 v80.77,10.92
  Bottom 0.254: v43.2,33.58 v45.95,36.32 60.58,36.32 63.32,33.58 63.32,32.66 61.95,31.29 58.06,31.29 56.46,29.69 56.46,28.78 58.52,26.72 v63.32,26.72 64.47,26.72 v66.06,28.32 67.89,30.15 80.01,30.15 80.47,30.61 81.38,30.61 83.9,28.09 U$3.5 83.9,27.86 83.9,26.04 86.41,23.52 86.41,11.86 84.58,10.03 | 66.52,2.95 68.35,2.95 77.04,11.63 81.03,11.63 | 66.52,2.95 20.57,2.95 SV3.6 | 81.03,11.63 82.98,11.63 84.58,10.03 | 84.58,10.03 SV1.1 | 66.52,2.95 v66.52,5 | v80.77,10.92 80.77,11.38 81.03,11.63
N$1
  Top 0.254: R1.2 7.31,39.52 9.37,37.47 LED2.C
N$2
  Top 0.254: U$2.6 11.89,29.46 11.89,33.12 7.31,37.69 R1.1
N$3
  Top 0.254: R2.2 13.95,37.92 13.49,37.92 11.89,39.52 LED1.C
N$4
  Top 0.254: U$2.7 10.97,29.23 11.89,28.32 14.63,28.32 15.32,29.01 15.32,38.15 14.17,39.29 R2.1
N$5
  Top 0.254: U$2.2 10.97,23.98 14.86,20.09 R3.2
N$6
  Top 0.254: U$5.P2 37.72,34.49 38.41,33.81 38.41,27.18 U4.3 38.41,26.95 38.41,26.04 34.98,22.61 34.98,21.01 U$6.1
N$7
  Top 0.254: U4.4 37.03,29.69 37.03,27.41 U4.2 36.8,27.18 36.8,25.12 33.38,21.69 33.38,19.86 33.83,19.41 37.95,19.41 39.32,20.78 U$6.2 39.55,21.01 39.55,25.81 42.98,29.23 SW2.COM1 43.2,29.46 44.58,30.84 44.58,36.55 C6.1
N$8
  Top 0.254: 20.8,35.41 20.8,35.18 20.12,34.49 20.12,29.69 T1.1 | 20.8,35.41 21.26,35.41 T1.6 | 20.8,35.41 T1.7
N$9
  Top 0.254: U$1.1 20.12,22.84 20.12,23.29 18.97,24.44 18.97,26.04 21.95,29.01 21.95,29.46 T1.4
N$10
  Top 0.254: U$1.3 21.95,22.84 20.57,24.21 19.89,24.21 19.43,24.66 19.43,25.81 22.63,29.01 22.63,34.72 21.95,35.41 T1.5
N$11
  Top 0.254: U$1.2 21.03,22.61 18.29,19.86 R4.2
N$12  (via drill 3.3)
  other vias: 2.54,3.81
N$13
  Top 0.254: U$1.5 21.26,24.89 21.26,24.66 22.63,23.29 22.63,19.41 21.72,18.49 C3.1 21.49,18.26 21.49,15.75 R5.2
N$14  (via drill 3.3)
  other vias: 2.54,16.51
N$15
  Top 0.254: Q1.2 53.95,32.21 55.55,30.61 58.75,30.61 C7.2 58.98,30.38 59.66,29.69 59.66,27.41 61.27,25.81 61.72,25.81 U3.7
N$16
  Top 0.254: U3.8 61.72,24.89 60.58,23.75 58.75,23.75 C8.2 58.52,23.52 54.86,23.52 53.95,22.61 Q1.1
N$17  (via drill 0.61)
  Top 0.254: v67.89,14.15 67.89,12.32 IC3.14 | v49.61,19.18 48.92,19.18 45.72,22.38 BAT1.1
  Bottom 0.254: v67.89,14.15 62.64,14.15 57.61,19.18 v49.61,19.18
N$18
  Top 0.254: C11.2 68.35,37.92 68.35,35.87 71.55,32.66 71.55,27.86 71.09,27.41 70.64,27.41 U3.20
N$19
  Top 0.254: R15.1 74.52,24.89 79.78,24.89 84.35,20.32 SV1.5
N$20  (via drill 3.3)
  other vias: 96.52,16.51
N$21  (via drill 3.3)
  other vias: 96.52,3.81
N$22
  Top 0.254: R6.1 35.43,2.72 35.43,6.15 OK1.1
N$23
  Top 0.254: R7.1 41.83,2.49 41.83,6.15 OK2.1
N$24
  Top 0.254: R8.1 48.23,2.49 48.23,6.15 OK3.1
N$25
  Top 0.254: R9.1 54.41,2.72 54.41,5.92 OK4.1
N$26  (via drill 3.3)
  other vias: 96.52,40.64
N$27  (via drill 3.3)
  other vias: 2.54,40.64
N$28  (via drill 0.61)
  Top 0.254: v38.41,10.72 39.32,9.8 39.32,5.46 37.26,3.4 37.26,2.72 R6.2 | v62.41,33.12 63.32,32.21 U3.32
  Bottom 0.254: v38.41,10.72 38.41,13.69 45.95,21.23 46.63,21.23 59.21,33.81 61.72,33.81 v62.41,33.12
N$29
  Top 0.254: R7.2 43.2,2.49 43.2,5 42.98,5.23 42.98,7.06 50.06,14.15 51.89,14.15 52.35,14.61 52.35,34.72 52.81,35.18 57.38,35.18 61.72,30.84 U3.1
N$30
  Top 0.254: R8.2 50.29,2.49 50.29,3.63 53.03,6.37 53.03,9.58 62.64,19.18 62.64,24.21 64.24,25.81 64.24,28.09 62.64,29.69 61.95,29.69 U3.2
N$31
  Top 0.254: R9.2 56.46,2.72 58.98,5.23 59.21,5.23 63.55,9.58 63.55,23.52 U3.9
N$34
  Top 0.254: U3.12 65.84,23.52 65.84,21.23 67.21,19.86 70.87,19.86 73.38,22.38 73.38,25.58 73.84,26.04 79.32,26.04 81.15,27.86 U$3.4
N$35  (via drill 0.61)
  Top 0.254: v67.67,20.78 66.75,21.69 66.75,23.52 U3.13 | v75.44,20.78 81.38,20.78 83.21,18.95 85.72,18.95 88.7,21.92 88.7,27.86 U$3.7
  Bottom 0.254: v75.44,20.78 v67.67,20.78
N$36  (via drill 0.61)
  Top 0.254: v71.32,21.69 70.87,21.23 68.58,21.23 67.44,22.38 67.44,23.52 U3.14 | v77.72,19.86 79.78,19.86 83.21,16.43 85.72,16.43 v87.32,18.03
  Bottom 0.254: v71.32,21.69 75.9,21.69 v77.72,19.86 | v87.32,18.03 87.32,23.29 85.95,24.66 85.95,27.64 86.18,27.86 U$3.6
N$41
  Top 0.254: C9.1 13.95,15.52 13.95,10.03 14.86,9.12 SV2.4
RESET  (via drill 0.61)
  Top 0.254: C9.2 15.54,15.52 15.54,10.95 16.23,10.26 16.23,7.75 13.26,4.78 12.12,4.78 10.29,2.95 SV3.2 | U3.29 65.61,32.21 65.61,33.81 63.32,36.09 S1.4 63.09,36.32 58.29,36.32 S1.3 58.06,36.32 52.81,36.32 | 52.81,36.32 50.29,38.84 R14.1 | v32.69,11.63 46.86,11.63 49.84,14.61 51.66,14.61 51.89,14.83 51.89,35.41 52.81,36.32
  Bottom 0.254: v32.69,11.63 25.38,11.63 20.8,7.06 14.4,7.06 10.29,2.95 SV3.2
RX  (via drill 0.61)
  Top 0.254: v61.04,32.89 62.87,31.06 64.69,31.06 64.92,31.29 64.92,31.98 U3.30 | v31.09,13.23 v39.32,13.23
  Bottom 0.254: v61.04,32.89 58.98,32.89 v39.32,13.23 | v31.09,13.23 16.92,13.23 13.72,10.03 13.72,7.75 13.03,7.06 11.89,7.06 10.06,8.89 SV2.2
SCL  (via drill 0.61)
  Top 0.203: 80.01,6.6 80.01,11.68 80.14,11.81 82.3,11.81 82.63,11.48 83.1,11.48 83.42,11.16 83.69,11.43 86.87,11.43 87.38,11.94 87.38,12.45 85.88,13.95 85.88,14.07
  Top 0.254: IC3.16 65.61,12.09 65.61,11.41 66.29,10.72 66.29,10.16 67.31,9.14 68.07,9.14 68.35,9.42 68.35,10.72 68.58,10.95 68.58,13.46 68.81,13.69 71.09,13.69 73.84,16.43 R13.1 74.07,16.43 76.58,13.92 80.26,13.92 | v66.52,30.61 66.52,31.98 U3.28 | v92.81,21.01 85.88,14.07 85.72,13.92 80.26,13.92 | U1.6 81.27,5.34 80.01,6.6 | 80.01,13.66 80.26,13.92
  Bottom 0.254: v66.52,30.61 79.78,30.61 80.24,31.06 90.3,31.06 92.81,28.55 v92.81,21.01
SDA  (via drill 0.6 pad 0.25, 0.6 pad 0.3, 0.61)
  Top 0.254: 66.98,15.98 66.98,12.55 66.75,12.32 IC3.15 66.67,11.05 v67.31,10.41 | 66.98,15.98 66.98,16.43 R12.1 66.98,15.98 | v67.89,27.86 67.44,28.32 67.44,31.98 U3.27 | 66.98,15.98 v65.84,15.98 | U1.1 78.47,5.83 79.25,6.6 79.25,10.92 78.49,11.68 76.3,11.68 74.85,10.24 74.85,8.38 71.88,8.38 v71.63,8.64
  Bottom 0.254: v67.89,27.86 67.89,23.06 65.84,21.01 v65.84,15.98 | v71.63,8.64 69.6,8.64 68.07,10.16 67.56,10.16 v67.31,10.41
T1  (via drill 0.61)
  Top 0.254: v37.72,18.49 37.72,15.75 OK1.3
  Bottom 0.254: v37.72,18.49 37.72,20.78 7.09,51.41 7.09,51.87 N1.A
T2  (via drill 0.61)
  Top 0.254: v44.12,25.81 44.12,15.98 OK2.3 | v29.49,45.92 29.49,51.64 29.72,51.87 N2.A
  Bottom 0.254: v44.12,25.81 44.12,31.29 v29.49,45.92
T3  (via drill 0.61)
  Top 0.254: v42.98,48.21 29.03,34.27 29.03,18.49 33.38,14.15 48.69,14.15 50.06,15.52 50.52,15.52 OK3.3
  Bottom 0.254: v42.98,48.21 61.49,48.21 62.41,49.12 62.41,51.18 61.72,51.87 N3.A
T4  (via drill 0.61)
  Top 0.254: v61.72,20.55 56.92,15.75 OK4.3 | v80.92,29.69 88.01,29.69 93.27,34.95 93.27,38.38 84.58,47.07 84.58,51.87 N4.A
  Bottom 0.254: v61.72,20.55 61.72,22.61 66.98,27.86 66.98,28.32 68.35,29.69 v80.92,29.69
TX  (via drill 0.61)
  Top 0.254: v59.21,34.72 62.18,34.72 64.01,32.89 64.01,32.21 U3.31
  Bottom 0.254: v59.21,34.72 55.55,34.72 38.41,17.58 32.69,17.58 19.89,30.38 13.95,30.38 12.57,29.01 12.57,9.12 SV2.3
VBUS  (via drill 0.61)
  Top 0.254: LED1.A 11.66,37.47 9.6,39.52 LED2.A 9.37,39.75 8.46,39.75 7.54,40.66 6.63,40.66 6.17,40.21 6.17,32.66 9.37,29.46 U$2.8 | 8.87,28.6 v11.66,25.81 13.26,24.21 U$2.4 | v8.46,22.61 8.46,19.86 C4.1
  Top 0.406: U2.VBUS1 8.24,27.97 8.87,28.6 U$2.8
  Bottom 0.254: v11.66,25.81 v8.46,22.61

### Text on the board
Dimension: B- | B+
tPlace: Tony & Stella | IN-2 Clock Ver.1 | 2017/08/10